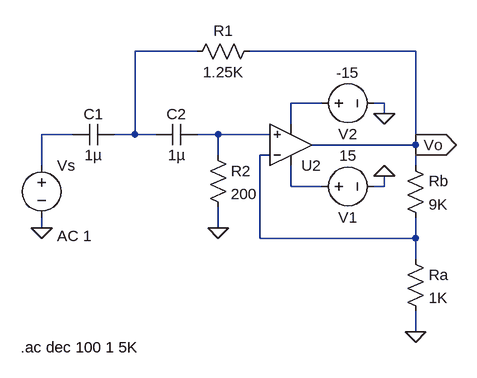
[diagram p0: schematic Run_2.asc]
Run_2.asc, the LTspice schematic file:
Version 4
SHEET 1 880 680
WIRE -192 -16 -288 -16
WIRE 144 -16 -112 -16
WIRE 0 64 -48 64
WIRE 96 64 80 64
WIRE 96 80 96 64
WIRE -48 96 -48 64
WIRE -384 112 -432 112
WIRE -288 112 -288 -16
WIRE -288 112 -320 112
WIRE -256 112 -288 112
WIRE -160 112 -192 112
WIRE -80 112 -160 112
WIRE 144 128 144 -16
WIRE 144 128 -16 128
WIRE -160 144 -160 112
WIRE -80 144 -96 144
WIRE -432 160 -432 112
WIRE 144 160 144 128
WIRE -48 192 -48 160
WIRE 0 192 -48 192
WIRE 96 192 96 176
WIRE 96 192 80 192
WIRE -432 256 -432 240
WIRE -160 256 -160 224
WIRE -96 272 -96 144
WIRE 144 272 144 240
WIRE 144 272 -96 272
WIRE 144 304 144 272
WIRE 144 416 144 384
FLAG -432 256 0
FLAG 144 416 0
FLAG -160 256 0
FLAG 144 128 Vo
IOPIN 144 128 Out
FLAG 96 176 0
FLAG 96 80 0
SYMBOL voltage -432 144 R0
WINDOW 123 24 124 Left 2
WINDOW 39 0 0 Left 0
SYMATTR Value2 AC 1
SYMATTR InstName Vs
SYMATTR Value ""
SYMBOL cap -320 96 R90
WINDOW 0 0 32 VBottom 2
WINDOW 3 32 32 VTop 2
SYMATTR InstName C1
SYMATTR Value 1µ
SYMBOL cap -192 96 R90
WINDOW 0 0 32 VBottom 2
WINDOW 3 32 32 VTop 2
SYMATTR InstName C2
SYMATTR Value 1µ
SYMBOL res -176 128 R0
SYMATTR InstName R2
SYMATTR Value 200
SYMBOL res -96 -32 R90
WINDOW 0 0 56 VBottom 2
WINDOW 3 32 56 VTop 2
SYMATTR InstName R1
SYMATTR Value 1.25K
SYMBOL res 128 288 R0
SYMATTR InstName Ra
SYMATTR Value 1K
SYMBOL res 128 144 R0
SYMATTR InstName Rb
SYMATTR Value 9K
SYMBOL OpAmps\\UniversalOpamp2 -48 128 M180
SYMATTR InstName U2
SYMBOL voltage -16 192 M90
WINDOW 0 32 56 VTop 2
WINDOW 3 -32 56 VBottom 2
WINDOW 123 0 0 Left 0
WINDOW 39 0 0 Left 0
SYMATTR InstName V1
SYMATTR Value 15
SYMBOL voltage -16 64 M90
WINDOW 0 32 56 VTop 2
WINDOW 3 -32 56 VBottom 2
WINDOW 123 0 0 Left 0
WINDOW 39 0 0 Left 0
SYMATTR InstName V2
SYMATTR Value -15
TEXT -464 440 Left 2 !.ac dec 100 1 5K

The netlist it stands for:
* Run_2.asc
Vs N003 0 AC 1
C1 N001 N003 1µ
C2 N004 N001 1µ
R2 N004 0 200
R1 Vo N001 1.25K
Ra N005 0 1K
Rb Vo N005 9K
XU2 N004 N005 N006 N002 Vo level.2 Avol=1Meg GBW=10Meg Slew=10Meg ilimit=25m rail=0 Vos=0 phimargin=45 en=0 enk=0 in=0 ink=0 Rin=500Meg  ; pins IN+ IN- V+ V- OUT
V1 N006 0 15
V2 N002 0 -15
.ac dec 100 1 5K
.lib UniversalOpamps2.sub
.backanno
.end